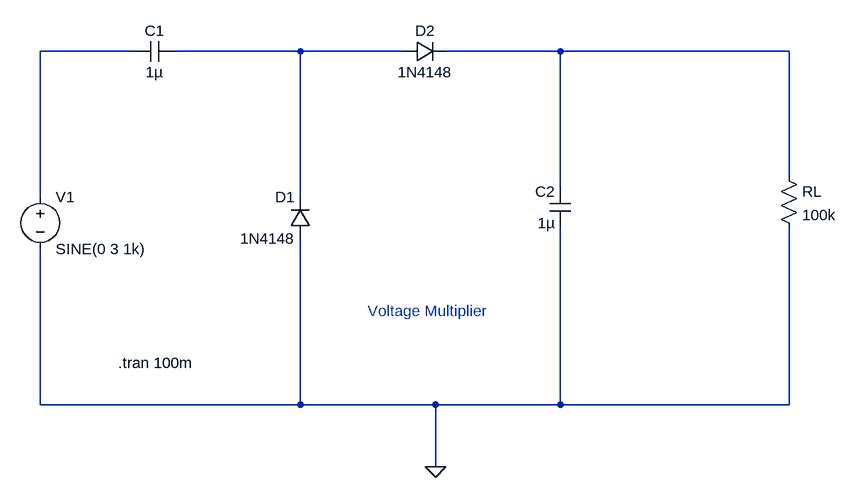
[diagram p0: schematic Voltage_Multiplier.asc]
Voltage_Multiplier.asc, the LTspice schematic file:
Version 4.1
SHEET 1 1072 680
WIRE -16 -176 -160 -176
WIRE 240 -176 48 -176
WIRE 400 -176 240 -176
WIRE 640 -176 464 -176
WIRE 992 -176 640 -176
WIRE 992 16 992 -176
WIRE 640 32 640 -176
WIRE -160 48 -160 -176
WIRE 240 48 240 -176
WIRE -160 368 -160 128
WIRE 240 368 240 112
WIRE 240 368 -160 368
WIRE 448 368 240 368
WIRE 640 368 640 96
WIRE 640 368 448 368
WIRE 992 368 992 96
WIRE 992 368 640 368
WIRE 448 464 448 368
FLAG 448 464 0
SYMBOL voltage -160 32 R0
WINDOW 123 0 0 Left 0
WINDOW 39 0 0 Left 0
SYMATTR InstName V1
SYMATTR Value SINE(0 3 1k)
SYMBOL diode 256 112 R180
WINDOW 0 24 64 Left 2
WINDOW 3 24 0 Left 2
SYMATTR InstName D1
SYMATTR Value 1N4148
SYMBOL diode 400 -160 R270
WINDOW 0 32 32 VTop 2
WINDOW 3 0 32 VBottom 2
SYMATTR InstName D2
SYMATTR Value 1N4148
SYMBOL cap 48 -192 R90
WINDOW 0 0 32 VBottom 2
WINDOW 3 32 32 VTop 2
SYMATTR InstName C1
SYMATTR Value 1µ
SYMBOL cap 656 96 R180
WINDOW 0 24 56 Left 2
WINDOW 3 24 8 Left 2
SYMATTR InstName C2
SYMATTR Value 1µ
SYMBOL res 976 0 R0
SYMATTR InstName RL
SYMATTR Value 100k
TEXT -40 304 Left 2 !.tran 100m
TEXT 344 224 Left 2 ;Voltage Multiplier

The netlist it stands for:
* Voltage_Multiplier.asc
V1 N001 0 SINE(0 3 1k)
D1 0 N002 1N4148
D2 N002 N003 1N4148
C1 N002 N001 1µ
C2 0 N003 1µ
RL N003 0 100k
.model D D
.lib standard.dio
.tran 100m
* Voltage Multiplier
.backanno
.end